# Altium schematic sheet Conector_LRS_POT_Externa.SchDoc
size A4; SheetNumber: 11; SheetTotal: 24
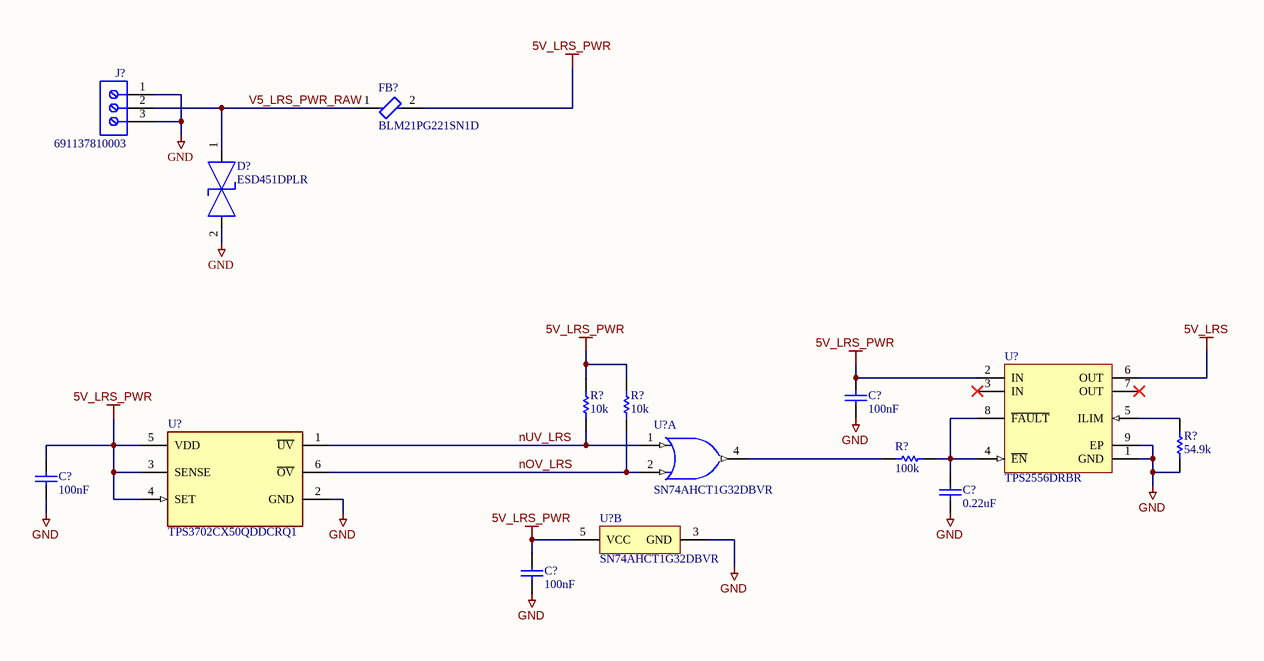
[diagram p0: Conector_LRS_POT_Externa.SchDoc]

## Parts
(Parts that share a designator on the sheet are numbered #1, #2 ... from top to bottom, then left to right.)
C?#1  100nF  [CAPC1005X55X25NL05T05]
C?#2  100nF  [CAPC1005X55X25NL05T05]
C?#3  0.22uF  [CAPC1005X56X25NL10T15]
C?#4  100nF  [CAPC1005X55X25NL05T05]
D?  ESD451DPLR  [FP-DPL0002A_MFG]
FB?  BLM21PG221SN1D  [FP-BLM21-0_2-t0_85-e0_5-IPC_B]
J?  691137810003  [691137810003]
R?#1  10k  [RESC1005X40X25ML05T05]
R?#2  10k  [RESC1005X40X25ML05T05]
R?#3  54.9k  [RESC1005X40X25ML05T05]
R?#4  100k  [RESC1005X40X25LL05T05]
U?#1  TPS2556DRBR  [DRB0008B_V]
U?#2  SN74AHCT1G32DBVR  [DBV0005A_M]  (part A of 2)
U?#3  TPS3702CX50QDDCRQ1  [FP-DDC0006A-IPC_C]
U?#4  SN74AHCT1G32DBVR  [DBV0005A_M]  (part B of 2)

## Nets
5V_LRS: U?#1.6(OUT)
5V_LRS_PWR: C?#1.2 C?#2.2 C?#4.2 FB?.2 R?#1.2 R?#2.2 U?#1.2(IN) U?#3.3(SENSE) U?#3.4(SET) U?#3.5(VDD) U?#4.5(VCC)
GND: C?#1.1 C?#2.1 C?#3.1 C?#4.1 D?.2(2_IO) J?.1 J?.3 R?#3.1 U?#1.1(GND) U?#1.9(EP) U?#3.2(GND) U?#4.3(GND)
nOV_LRS: R?#2.1 U?#2.2(B) U?#3.6(~{OV})
nUV_LRS: R?#1.1 U?#2.1(A) U?#3.1(~{UV})
V5_LRS_PWR_RAW: D?.1(1_IO) FB?.1 J?.2
NetC?#3_2: C?#3.2 R?#4.1 U?#1.4(~{EN}) U?#1.8(~{FAULT})
NetR?#3_2: R?#3.2 U?#1.5(ILIM)
NetR?#4_2: R?#4.2 U?#2.4(Y)

Not connected (* = marked no-connect by the designer): U?#1 3(IN)* 7(OUT)*

## Library data of the parts
C?#1 C?#2 C?#4 = CMP-2008-02030-1: Manufacturer: Vitramon; Part Number: VJ0402Y104KXJCW1BC
C?#3 = CMP-2008-02883-1: Manufacturer: AVX Interconnect / Elco; Part Number: 0402ZD224KAT2A
D? = CMP-00370-140306676-1: 0.5-pF, 5.5-V, 30-KV bidirectional ESD protection device in 0201 package 2-X2SON -40 to 125; Manufacturer Lifecycle Status: ACTIVE; Thickness: 300µm; ComponentLink3URL: https://www.ti.com/lit/ds/symlink/tpd1e04u04.pdf?ts=1701165483995&ref_url=https%253A%252F%252Fwww.ti.com%252Fproduct%252FTPD1E04U04%252Fpart-details%252FTPD1E04U04DPLR; ComponentLink3Description: Manufacturer's Package Drawing; Lifecycle Status: Production; ComponentLink1URL: http://ti.com; ComponentLink2Description: HelpURL; Width: 300µm; ComponentLink2URL: https://www.ti.com/lit/ds/symlink/esd451.pdf; Height: 320µm; Number of Pins: 2; ComponentLink1Description: Manufacturer's Website; Length: 600µm
FB? = CMP-0686-00610-3: Chip Ferrite Bead, 0805, 220Ω @ 100MHz, 0.045Ω, 25%, 2A; Number of Circuits: 1; Shielding: Unshielded; DC Resistance (DCR): 45mR; Impedance: 220R; Radiation Hardening: No; Material: Ferrite; Frequency: 100MHz; Width: 1.25mm; DC Current: 2A; Max DC Current: 2A; Number of Lines: 1; Package Quantity: 1; Case Code (Metric): 2012; Current Rating: 2A; Case/Package: 0805; Current: 2A; Military Standard: Not; Core Material: Ferrite; Depth: 1.25mm; Contact Plating: Tin; DC Resistance-Max: 45mR; Max Operating Temperature: 125°C; Length: 2mm; Max Current Rating: 2A; REACH SVHC: No SVHC; Termination: SMD/SMT; Min Operating Temperature: -55°C; Series: BLM21P; Test Frequency: 100MHz; Tolerance: 25%; Number of Pins: 2; RoHS Compliant: Yes; Height: 0.85mm; Packaging: Tape and Reel; Lead Free: Lead Free; Case Code (Imperial): 0805
J? = CMP-1502-03382-3: 10.00 mm Terminal Block, Horizontal Entr
R?#1 R?#2 = CMP-2002-00601-1: Manufacturer: Panasonic; Part Number: ERJ-2RHD1002X
R?#3 = CMP-2002-00991-1: Manufacturer: Panasonic; Part Number: ERJ-2RKF5492X
R?#4 = CMP-2002-00602-1: Manufacturer: Panasonic; Part Number: ERJ-2RHD1003X
U?#1 = CMP-0337-00218-2: Precision Adjustable Current-Limited Power-Distribution Switch, 0.5 to 5.0 A Current Limit, -40 to 85 degC, 8-pin SON (DRB), Green (RoHS & no Sb/Br); Manufacturer: Texas Instruments; Current Limit Accuracy @ 1A: +/-7.0% (4100mA min / 4715mA max); Rating: Catalog; Current Limit Topology: Constant-Current; Continuous Current(Max)(A): 5; rDS(on) per FET(Typ)(mOhms): 22; Vin(Max)(V): 6.5; Number of Switches: 1; Enable: Active Low; Vin(Min)(V): 2.5; PartNumber: TPS2556DRBR; ComponentLink1URL: http://www.ti.com/general/docs/lit/getliterature.tsp?genericPartNumber=TPS2556&fileType=pdf; ComponentLink1Description: Datasheet; Eco-Plan: Green (RoHS & no Sb/Br); PackageReference: DRB0008B; PackageVersion: revK, Jun-2012; PackageDescription: 8-Pin Plastic Small Outline No-Lead, 3 x 3 x 1 mm Body, 0.65 mm Pitch, Exposed Pad; Mounting Technology: Surface Mount; DatasheetVersion: SLVS931A; Current Limit(A): 0.5 to 5.0
U?#2 U?#4 = CMP-0859-00067-3: Single 2-Input Positive-OR Gate, DBV0005A, LARGE T&R; Manufacturer: Texas Instruments; Technology Family: AHCT; VCC(Min)(V): 2; Voltage(Nom)(V): 5; Schmitt Trigger: No; Gate Type: OR; Sub-Family: OR Gate; Input Type: CMOS; ICC @ Nom Voltage(Max)(mA): 0.01; VCC(Max)(V): 5.5; Bits(#): 1; F @ Nom Voltage(Max)(Mhz): 75; Output Drive (IOL/IOH)(Max)(mA): 8/-8; tpd @ Nom Voltage(Max)(ns): 8; Logic: True; Rating: Catalog; Operating Temperature Range(C): -40 to 125; Generic Part Number: SN74AHCT1G32; DatasheetVersion: SCLS320O; PackageReference: DBV0005A; 3-State Output: No; Output Type: CMOS
U?#3 = CMP-04919-000045-1: IC SUPERVISOR 1 CHANNEL TSOT23-6; Reset: Active Low; Threshold Voltage: 5V; Number of Voltages Monitored: 1; Quiescent Current: 6uA; Mount: Surface Mount; Packaging: Tape and Reel; RoHS Compliant: Yes; Case/Package: SOT-23-6; Max Operating Temperature: 125°C; Lead Free: Lead Free; Type: Voltage Detector; Min Operating Temperature: -40°C